# EAGLE board M1705X (EAGLE 6.6.0), part 1 of 2
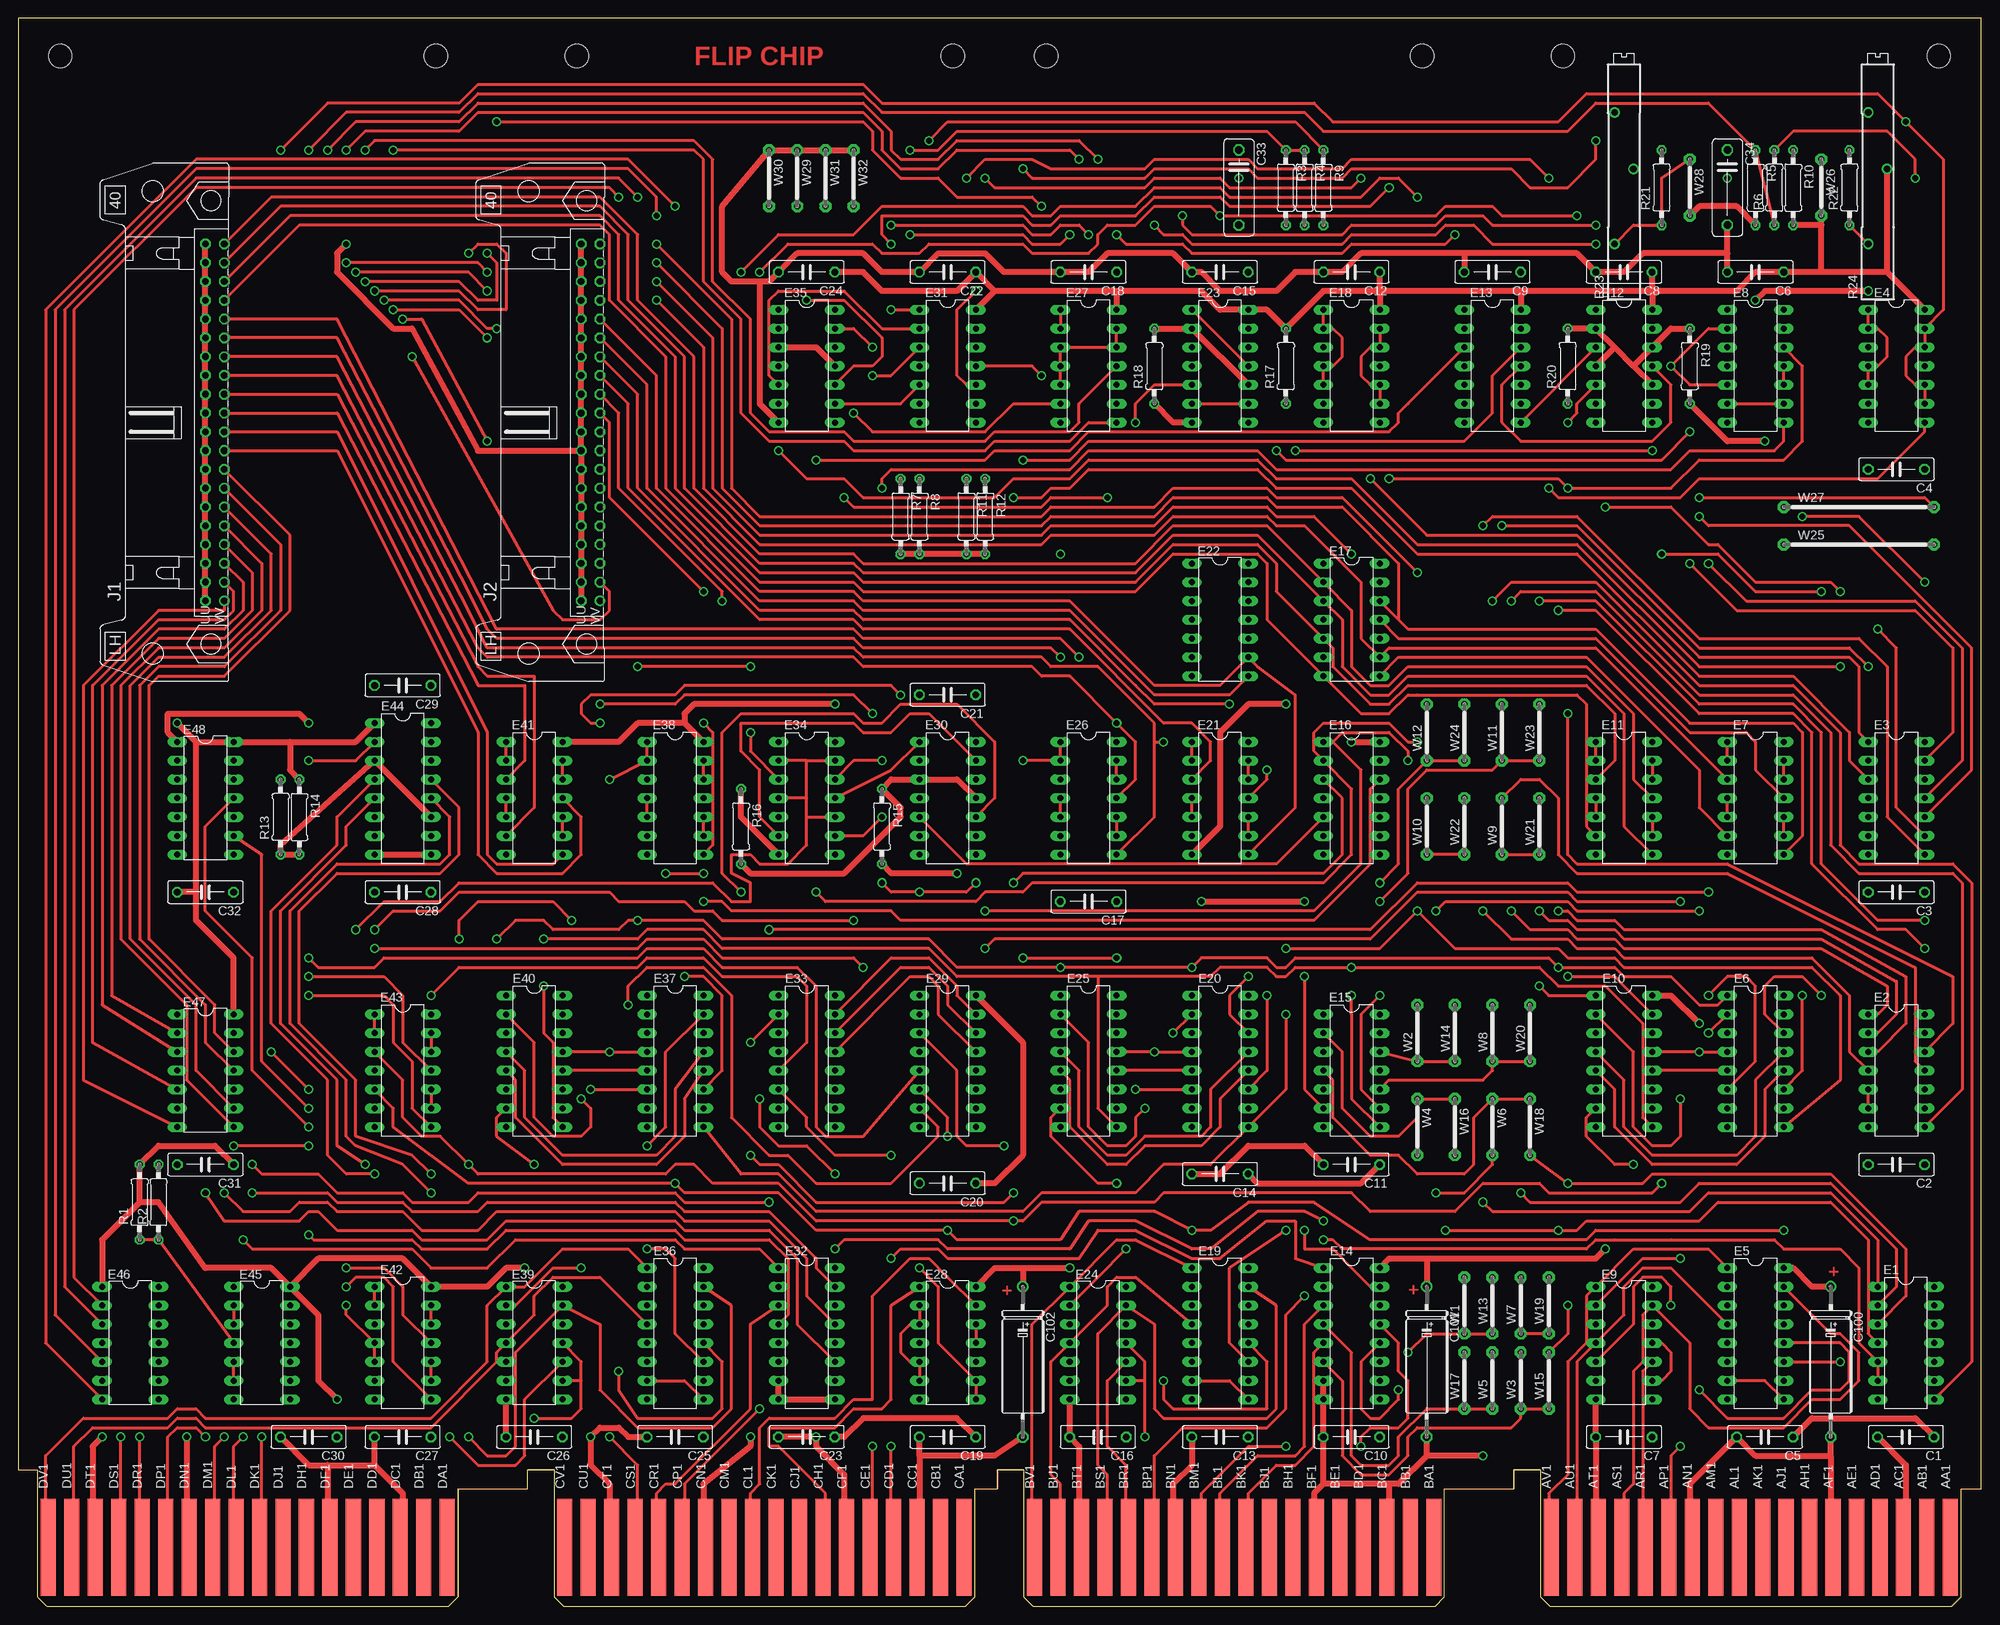
[diagram p3: board, top side]
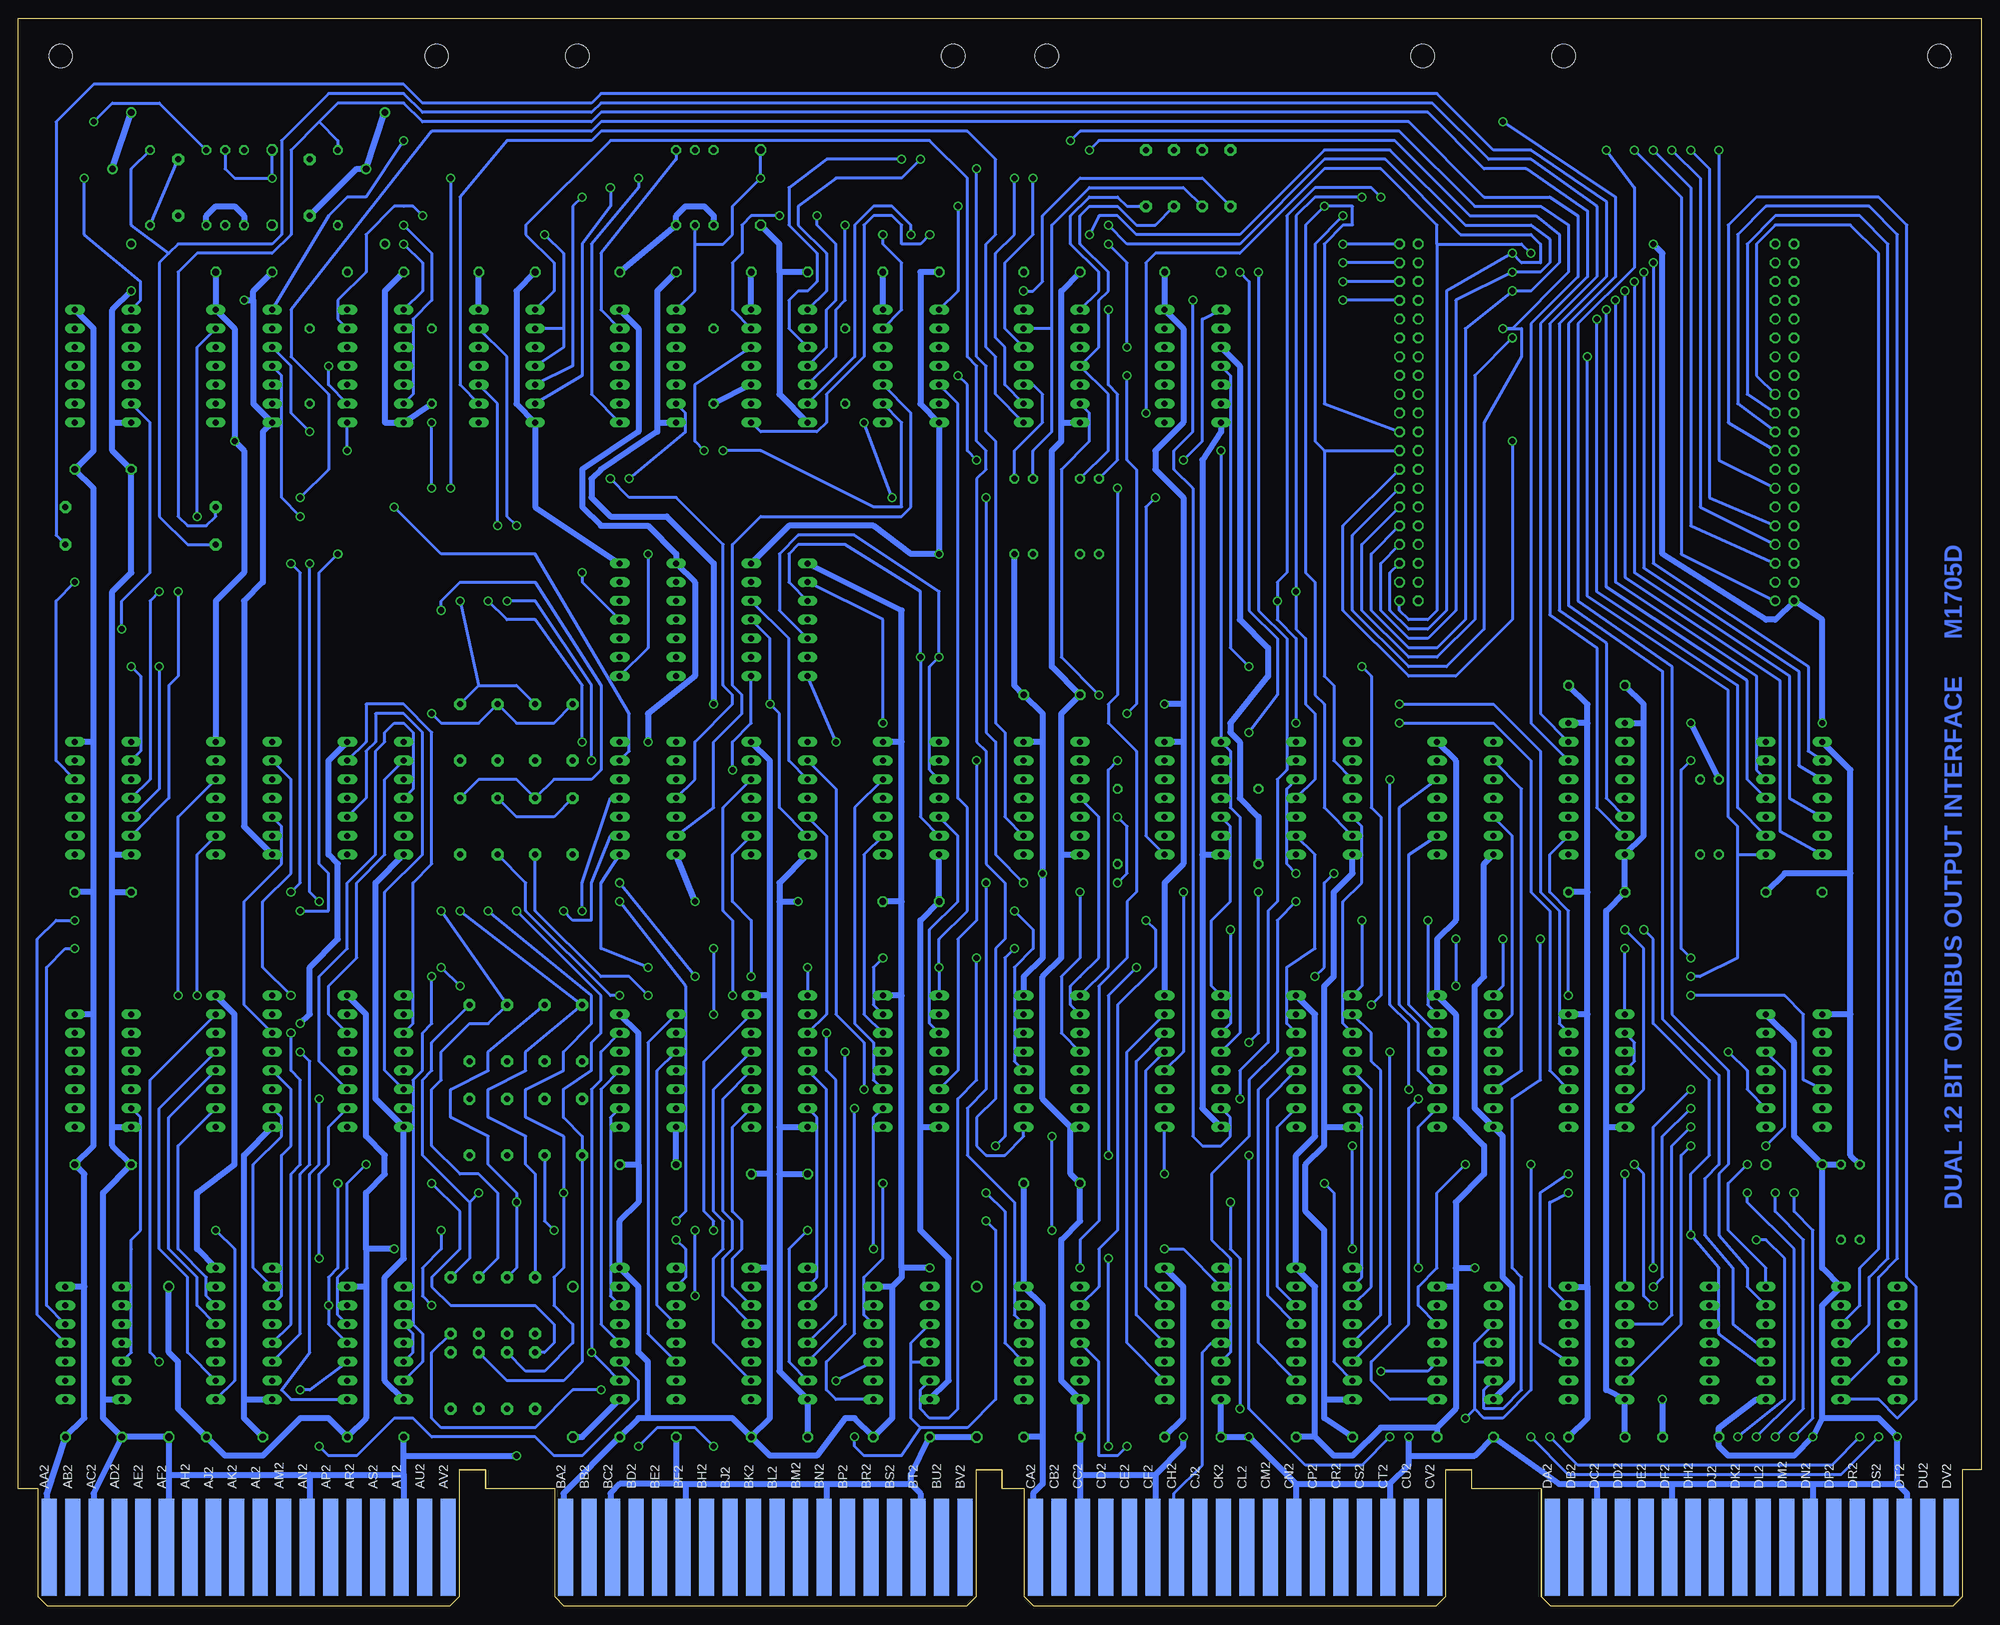
[diagram p4: board, bottom side, seen from below]

Size 265.3 x 214.63 mm. Coordinates in mm from the lower left corner, seen from the top.
Copper layers (1+16): Top 0.035mm / dielectric 1.5mm / Bottom 0.035mm
Design rules "16mils": minimum track width 16mil, minimum drill 32mil, track to track 15mil, track to pad 10mil, pad to pad 10mil, via to via 10mil, smd to smd 10mil, copper to edge 13mil, drill to drill 10mil, minimum pad ring 10mil, minimum via ring 8mil, stop-mask expansion 0mil, vias tented up to drill 0mil, thermal gap 10mil
Net classes: 1 Supply: width 0.813 mm

## Footprints (pad centres in the part's own frame; a part is rotated, then mirrored left to right if it is on the bottom)
C075-032X103 = drill 0.914 octagon: 1 -3.81,0; 2 3.81,0
C102-043X133 = drill 1.016 octagon: 1 -5.08,0; 2 5.08,0
E12-8 = drill 1.016: + -10.16,0 | drill 1.016 octagon: - 10.16,0
DIL14 = drill 0.813 long: 1 -7.62,-3.81; 2 -5.08,-3.81; 3 -2.54,-3.81; 4 0,-3.81; 5 2.54,-3.81; 6 5.08,-3.81; 7 7.62,-3.81; 8 7.62,3.81; 9 5.08,3.81; 10 2.54,3.81; 11 0,3.81; 12 -2.54,3.81; 13 -5.08,3.81; 14 -7.62,3.81
DIL16 = drill 0.813 long: 1 -8.89,-3.81; 2 -6.35,-3.81; 3 -3.81,-3.81; 4 -1.27,-3.81; 5 1.27,-3.81; 6 3.81,-3.81; 7 6.35,-3.81; 8 8.89,-3.81; 9 8.89,3.81; 10 6.35,3.81; 11 3.81,3.81; 12 1.27,3.81; 13 -1.27,3.81; 14 -3.81,3.81; 15 -6.35,3.81; 16 -8.89,3.81
DEC40PINH = drill 0.914 octagon: A 24.13,1.27; AA -3.81,1.27; B 24.13,-1.27; BB -3.81,-1.27; C 21.59,1.27; CC -6.35,1.27; D 21.59,-1.27; DD -6.35,-1.27; E 19.05,1.27; EE -8.89,1.27; F 19.05,-1.27; FF -8.89,-1.27; H 16.51,1.27; HH -11.43,1.27; J 16.51,-1.27; JJ -11.43,-1.27; K 13.97,1.27; KK -13.97,1.27; L 13.97,-1.27; LL -13.97,-1.27; M 11.43,1.27; MM -16.51,1.27; N 11.43,-1.27; NN -16.51,-1.27; P 8.89,1.27; PP -19.05,1.27; R 8.89,-1.27; RR -19.05,-1.27; S 6.35,1.27; SS -21.59,1.27; T 6.35,-1.27; TT -21.59,-1.27; U 3.81,1.27; UU -24.13,1.27; V 3.81,-1.27; W 1.27,1.27; X 1.27,-1.27; Y -1.27,1.27; Z -1.27,-1.27 | drill 0.914: VV -24.13,-1.27
0207/10 = drill 0.813 octagon: 1 -5.08,0; 2 5.08,0
3006Y = drill 0.9: 1 -8.89,1.27; 2 1.27,-1.27; 3 8.89,1.27
EDGE-CON8 = smd 2.032 x 13.106: AA1 261.303,7.938; AB1 258.127,7.938; AC1 254.952,7.938; AD1 251.778,7.938; AE1 248.602,7.938; AF1 245.428,7.938; AH1 242.252,7.938; AJ1 239.077,7.938; AK1 235.903,7.938; AL1 232.727,7.938; AM1 229.553,7.938; AN1 226.377,7.938; AP1 223.202,7.938; AR1 220.028,7.938; AS1 216.852,7.938; AT1 213.678,7.938; AU1 210.502,7.938; AV1 207.327,7.938; BA1 191.452,7.938; BB1 188.278,7.938; BC1 185.102,7.938; BD1 181.928,7.938; BE1 178.752,7.938; BF1 175.577,7.938; BH1 172.403,7.938; BJ1 169.227,7.938; BK1 166.053,7.938; BL1 162.877,7.938; BM1 159.702,7.938; BN1 156.528,7.938; BP1 153.352,7.938; BR1 150.178,7.938; BS1 147.002,7.938; BT1 143.827,7.938; BU1 140.653,7.938; BV1 137.477,7.938; CA1 127.953,7.938; CB1 124.778,7.938; CC1 121.603,7.938; CD1 118.427,7.938; CE1 115.252,7.938; CF1 112.078,7.938; CH1 108.903,7.938; CJ1 105.728,7.938; CK1 102.552,7.938; CL1 99.377,7.938; CM1 96.203,7.938; CN1 93.028,7.938; CP1 89.853,7.938; CR1 86.677,7.938; CS1 83.502,7.938; CT1 80.328,7.938; CU1 77.153,7.938; CV1 73.978,7.938; DA1 58.102,7.938; DB1 54.928,7.938; DC1 51.752,7.938; DD1 48.578,7.938; DE1 45.403,7.938; DF1 42.227,7.938; DH1 39.053,7.938; DJ1 35.877,7.938; DK1 32.703,7.938; DL1 29.527,7.938; DM1 26.352,7.938; DN1 23.177,7.938; DP1 20.003,7.938; DR1 16.828,7.938; DS1 13.652,7.938; DT1 10.477,7.938; DU1 7.303,7.938; DV1 4.128,7.938 | smd 2.032 x 13.106 bottom: AA2 261.303,7.938; AB2 258.127,7.938; AC2 254.952,7.938; AD2 251.778,7.938; AE2 248.602,7.938; AF2 245.428,7.938; AH2 242.252,7.938; AJ2 239.077,7.938; AK2 235.903,7.938; AL2 232.727,7.938; AM2 229.553,7.938; AN2 226.377,7.938; AP2 223.202,7.938; AR2 220.028,7.938; AS2 216.852,7.938; AT2 213.678,7.938; AU2 210.502,7.938; AV2 207.327,7.938; BA2 191.452,7.938; BB2 188.278,7.938; BC2 185.102,7.938; BD2 181.928,7.938; BE2 178.752,7.938; BF2 175.577,7.938; BH2 172.403,7.938; BJ2 169.227,7.938; BK2 166.053,7.938; BL2 162.877,7.938; BM2 159.702,7.938; BN2 156.528,7.938; BP2 153.352,7.938; BR2 150.178,7.938; BS2 147.002,7.938; BT2 143.827,7.938; BU2 140.653,7.938; BV2 137.477,7.938; CA2 127.953,7.938; CB2 124.778,7.938; CC2 121.603,7.938; CD2 118.427,7.938; CE2 115.252,7.938; CF2 112.078,7.938; CH2 108.903,7.938; CJ2 105.728,7.938; CK2 102.552,7.938; CL2 99.377,7.938; CM2 96.203,7.938; CN2 93.028,7.938; CP2 89.853,7.938; CR2 86.677,7.938; CS2 83.502,7.938; CT2 80.328,7.938; CU2 77.153,7.938; CV2 73.978,7.938; DA2 58.102,7.938; DB2 54.928,7.938; DC2 51.752,7.938; DD2 48.578,7.938; DE2 45.403,7.938; DF2 42.227,7.938; DH2 39.053,7.938; DJ2 35.877,7.938; DK2 32.703,7.938; DL2 29.527,7.938; DM2 26.352,7.938; DN2 23.177,7.938; DP2 20.003,7.938; DR2 16.828,7.938; DS2 13.652,7.938; DT2 10.477,7.938; DU2 7.303,7.938; DV2 4.128,7.938
OMNIBUS = hole 3.175: 208.915,209.55; 259.715,209.55; 189.865,209.55; 139.065,209.55; 75.616,209.55; 126.416,209.55; 56.566,209.55; 5.766,209.55
07 = drill 0.813 pad 1.6 octagon: 1 -3.81,0; 2 3.81,0
20 = drill 0.813 pad 1.6 octagon: 1 -10.16,0; 2 10.16,0

## Placement (x,y rotation side)
C1  .01uF  [C075-032X103]  255.14,22.86 180 top
C2  .01uF  [C075-032X103]  253.87,59.69 180 top
C3  .01uF  [C075-032X103]  253.87,96.52 180 top
C4  .01uF  [C075-032X103]  253.87,153.67 180 top
C5  .01uF  [C075-032X103]  236.09,22.86 180 top
C6  .01uF  [C075-032X103]  234.82,180.34 180 top
C7  .01uF  [C075-032X103]  217.04,22.86 180 top
C8  .01uF  [C075-032X103]  217.04,180.34 180 top
C9  .01uF  [C075-032X103]  199.26,180.34 180 top
C10  .01uF  [C075-032X103]  180.21,22.86 180 top
C11  .01uF  [C075-032X103]  180.21,59.69 180 top
C12  .01uF  [C075-032X103]  180.21,180.34 180 top
C13  .01uF  [C075-032X103]  162.43,22.86 180 top
C14  .01uF  [C075-032X103]  162.43,58.42 180 top
C15  .01uF  [C075-032X103]  162.43,180.34 180 top
C16  .01uF  [C075-032X103]  145.92,22.86 180 top
C17  .01uF  [C075-032X103]  144.65,95.25 180 top
C18  .01uF  [C075-032X103]  144.65,180.34 180 top
C19  .01uF  [C075-032X103]  125.6,22.86 180 top
C20  .01uF  [C075-032X103]  125.6,57.15 180 top
C21  .01uF  [C075-032X103]  125.6,123.19 180 top
C22  .01uF  [C075-032X103]  125.6,180.34 180 top
C23  .01uF  [C075-032X103]  106.55,22.86 180 top
C24  .01uF  [C075-032X103]  106.55,180.34 180 top
C25  .01uF  [C075-032X103]  88.77,22.86 180 top
C26  .01uF  [C075-032X103]  69.72,22.86 180 top
C27  .01uF  [C075-032X103]  51.94,22.86 180 top
C28  .01uF  [C075-032X103]  51.94,96.52 180 top
C29  .01uF  [C075-032X103]  51.94,124.46 180 top
C30  .01uF  [C075-032X103]  39.24,22.86 180 top
C31  .01uF  [C075-032X103]  25.27,59.69 180 top
C32  .01uF  [C075-032X103]  25.27,96.52 180 top
C33  68uF  [C102-043X133]  164.97,191.77 270 top
C34  68uF  [C102-043X133]  231.01,191.77 270 top
C100  6.8uF  [E12-8]  244.98,33.02 270 top
C101  6.8uF  [E12-8]  190.37,33.02 270 top
C102  6.8uF  [E12-8]  135.76,33.02 270 top
E1  7430N  [DIL14]  255.14,35.56 270 top
E2  7430N  [DIL14]  253.87,72.39 270 top
E3  7404N  [DIL14]  253.87,109.22 270 top
E4  7413N  [DIL14]  253.87,167.64 270 top
E5  8T38  [DIL16]  234.82,36.83 270 top
E6  74175N  [DIL16]  234.82,73.66 270 top
E7  7437N  [DIL14]  234.82,109.22 270 top
E8  7400N  [DIL14]  234.82,167.64 270 top
E9  N8881N  [DIL14]  217.04,35.56 270 top
E10  74175N  [DIL16]  217.04,73.66 270 top
E11  7437N  [DIL14]  217.04,109.22 270 top
E12  7474N  [DIL14]  217.04,167.64 270 top
E13  7408N  [DIL14]  199.26,167.64 270 top
E14  DS8837N  [DIL16]  180.21,36.83 270 top
E15  7404N  [DIL14]  180.21,72.39 270 top
E16  7400N  [DIL14]  180.21,109.22 270 top
E17  DEC2501  [DIL14]  180.21,133.35 270 top
E18  7413N  [DIL14]  180.21,167.64 270 top
E19  8T38  [DIL16]  162.43,36.83 270 top
E20  74175N  [DIL16]  162.43,73.66 270 top
E21  7437N  [DIL14]  162.43,109.22 270 top
E22  DEC2501  [DIL14]  162.43,133.35 270 top
E23  7437N  [DIL14]  162.43,167.64 270 top
E24  N8881N  [DIL14]  145.92,35.56 270 top
E25  74175N  [DIL16]  144.65,73.66 270 top
E26  7437N  [DIL14]  144.65,109.22 270 top
E27  7437N  [DIL14]  144.65,167.64 270 top
E28  N8881N  [DIL14]  125.6,35.56 270 top
E29  7442N  [DIL16]  125.6,73.66 270 top
E30  7474N  [DIL14]  125.6,109.22 270 top
E31  7486N  [DIL14]  125.6,167.64 270 top
E32  DS8837N  [DIL16]  106.55,36.83 270 top
E33  7442N  [DIL16]  106.55,73.66 270 top
E34  7408N  [DIL14]  106.55,109.22 270 top
E35  7474N  [DIL14]  106.55,167.64 270 top
E36  8T38  [DIL16]  88.77,36.83 270 top
E37  74175N  [DIL16]  88.77,73.66 270 top
E38  7437N  [DIL14]  88.77,109.22 270 top
E39  N8881N  [DIL14]  69.72,35.56 270 top
E40  74175N  [DIL16]  69.72,73.66 270 top
E41  7437N  [DIL14]  69.72,109.22 270 top
E42  7437N  [DIL14]  51.94,35.56 270 top
E43  7437N  [DIL14]  51.94,72.39 270 top
E44  74123N  [DIL16]  51.94,110.49 270 top
E45  N8881N  [DIL14]  32.89,35.56 270 top
E46  DEC2501  [DIL14]  15.11,35.56 270 top
E47  DEC2501  [DIL14]  25.27,72.39 270 top
E48  DEC2501  [DIL14]  25.27,109.22 270 top
J1  [DEC40PINH]  26.54,160.02 90 top
J2  [DEC40PINH]  77.34,160.02 90 top
R1  3.3K  [0207/10]  16.38,54.61 90 top
R2  10K  [0207/10]  18.92,54.61 90 top
R3  2.2K  [0207/10]  171.32,191.77 270 top
R4  2.2K  [0207/10]  173.86,191.77 270 top
R5  2.2K  [0207/10]  234.82,191.77 270 top
R6  2.2K  [0207/10]  237.36,191.77 90 top
R7  1K  [0207/10]  119.25,147.32 270 top
R8  1K  [0207/10]  121.79,147.32 270 top
R9  1.2K  [0207/10]  176.4,191.77 270 top
R10  1.2K  [0207/10]  239.9,191.77 270 top
R11  1K  [0207/10]  128.14,147.32 270 top
R12  1K  [0207/10]  130.68,147.32 270 top
R13  2.7K  [0207/10]  35.43,106.68 90 top
R14  7.5K  [0207/10]  37.97,106.68 270 top
R15  2.7K  [0207/10]  116.71,105.41 270 top
R16  7.5K  [0207/10]  97.66,105.41 270 top
R17  2.7K  [0207/10]  171.32,167.64 90 top
R18  7.5K  [0207/10]  153.54,167.64 90 top
R19  2.7K  [0207/10]  225.93,167.64 270 top
R20  7.5K  [0207/10]  209.42,167.64 90 top
R21  5.6K  [0207/10]  222.12,191.77 90 top
R22  5.6K  [0207/10]  247.52,191.77 90 top
R23  (option)  [3006Y]  217.04,193.04 90 top
R24  (option)  [3006Y]  251.33,193.04 90 top
U$2  [EDGE-CON8]  -0.13,0 0 top
U$3  [FLIPCHIP]  72.26,213.36 270 top
U$4  OUTLINE-OMNIBUS  [OMNIBUS]  -0.13,0 0 top
W1  J7MM  [07]  195.45,40.64 90 top
W2  J7MM  [07]  189.1,77.47 90 top
W3  J7MM  [07]  203.07,30.48 90 top
W4  J7MM  [07]  189.1,64.77 270 top
W5  J7MM  [07]  199.26,30.48 90 top
W6  J7MM  [07]  199.26,64.77 270 top
W7  J7MM  [07]  203.07,40.64 90 top
W8  J7MM  [07]  199.26,77.47 90 top
W9  J7MM  [07]  200.53,105.41 90 top
W10  J7MM  [07]  190.37,105.41 90 top
W11  J7MM  [07]  200.53,118.11 90 top
W12  J7MM  [07]  190.37,118.11 90 top
W13  J7MM  [07]  199.26,40.64 90 top
W14  J7MM  [07]  194.18,77.47 90 top
W15  J7MM  [07]  206.88,30.48 90 top
W16  J7MM  [07]  194.18,64.77 270 top
W17  J7MM  [07]  195.45,30.48 90 top
W18  J7MM  [07]  204.34,64.77 270 top
W19  J7MM  [07]  206.88,40.64 90 top
W20  J7MM  [07]  204.34,77.47 90 top
W21  J7MM  [07]  205.61,105.41 90 top
W22  J7MM  [07]  195.45,105.41 90 top
W23  J7MM  [07]  205.61,118.11 90 top
W24  J7MM  [07]  195.45,118.11 90 top
W25  J20MM  [20]  248.79,143.51 0 top
W26  J7MM  [07]  243.71,191.77 270 top
W27  J20MM  [20]  248.79,148.59 0 top
W28  J7MM  [07]  225.93,191.77 270 top
W29  J7MM  [07]  105.28,193.04 270 top
W30  J7MM  [07]  101.47,193.04 270 top
W31  J7MM  [07]  109.09,193.04 270 top
W32  J7MM  [07]  112.9,193.04 270 top

## Tracks (layer width: path | path; a pad name or v marks a point on that pad's centre or on a via)
3V1
  Top 0.813: R14.2 R13.1 35.43,102.87 E44.3 E44.11
3V2
  Top 0.813: R16.2 98.93,99.06 111.63,99.06 119.25,106.68 119.25,107.95 R15.1 117.98,111.76 E30.3 126.87,111.76 E30.11 | E35.3 107.82,170.18 E35.11
  Bottom 0.813: R16.2 97.66,106.68 100.2,109.22 100.2,116.84 101.47,118.11 101.47,119.38 96.39,125.73 96.39,129.54 100.2,133.35 100.2,167.64 E35.3
3V3
  Top 0.813: R18.2 E23.2 E23.10
  Bottom 0.813: E23.10 R17.1
3V4
  Top 0.813: R20.2 E12.2 215.77,170.18 | R19.1 223.39,172.72 E12.12 218.31,167.64 | 218.31,167.64 E12.10 | 215.77,170.18 218.31,167.64 | E12.4 215.77,170.18
!C0  (via drill 0.81)
  Top 0.406: U$2.CE1 115.44,8.26 v115.44,21.59
  Bottom 0.406: v115.44,21.59 116.71,20.32 119.25,20.32 119.25,33.02 E28.4
!C1
  Top 0.406: U$2.CH1 109.09,8.26 109.09,15.24 102.74,21.59 101.47,21.59 101.47,24.13 110.36,24.13 112.9,26.67 116.71,26.67 117.98,27.94 117.98,40.64 E28.1
!DATA0  (via drill 0.81)
  Top 0.406: U$2.AR1 219.58,8.26 219.58,31.75 E9.10 | v227.2,29.21 231.01,25.4 238.63,25.4 242.44,29.21 246.25,29.21 247.52,30.48 247.52,34.29 246.25,35.56 E5.12
  Bottom 0.406: E9.10 225.93,29.21 v227.2,29.21
!DATA1
  Top 0.406: U$2.AS1 217.04,8.26 217.04,15.24 218.31,16.51 218.31,31.75 219.58,33.02 219.58,39.37 E9.13 225.93,35.56 225.93,26.67 228.47,24.13 238.63,24.13 242.44,27.94 246.25,27.94 248.79,30.48 248.79,34.29 246.25,36.83 244.98,36.83 E5.15
!DATA2
  Top 0.406: U$2.AU1 210.69,8.26 210.69,33.02 E9.4 217.04,39.37 217.04,43.18 219.58,45.72 223.39,45.72 E5.4
!DATA3
  Top 0.406: U$2.AV1 206.88,8.26 206.88,15.24 209.42,17.78 209.42,33.02 211.96,35.56 211.96,41.91 E9.1 218.31,48.26 228.47,48.26 E5.1
!DATA4  (via drill 0.81)
  Top 0.406: U$2.BR1 149.73,8.26 149.73,19.05 147.19,21.59 147.19,30.48 E24.10 | E19.12 168.78,33.02 168.78,26.67 156.08,26.67 154.81,27.94 v154.81,30.48
  Bottom 0.406: E24.10 v154.81,30.48
!DATA5
  Top 0.406: U$2.BS1 147.19,8.26 147.19,17.78 145.92,19.05 145.92,36.83 E24.13 153.54,38.1 153.54,26.67 154.81,25.4 168.78,25.4 170.05,26.67 170.05,40.64 E19.15
!DATA6
  Top 0.406: U$2.BU1 140.84,8.26 140.84,16.51 139.57,17.78 139.57,33.02 E24.4 147.19,40.64 147.19,43.18 148.46,44.45 151,44.45 E19.4
!DATA7
  Top 0.406: U$2.BV1 137.03,8.26 137.03,38.1 E24.1 148.46,49.53 151,49.53 E19.1
!DATA8  (via drill 0.81)
  Top 0.406: U$2.DR1 16.38,8.26 v16.38,22.86 | v58.29,22.86 62.1,19.05 67.18,19.05 68.45,20.32 68.45,27.94 E39.10 | v81.15,31.75 81.15,29.21 83.69,25.4 93.85,25.4 95.12,26.67 95.12,33.02 E36.12
  Bottom 0.406: v16.38,22.86 20.19,19.05 54.48,19.05 v58.29,22.86 | E39.10 74.8,31.75 v81.15,31.75
!DATA9  (via drill 0.81)
  Top 0.406: U$2.DS1 13.84,8.26 v13.84,22.86 | v60.83,22.86 63.37,20.32 65.91,20.32 67.18,21.59 67.18,34.29 E39.13 78.61,38.1 78.61,29.21 83.69,24.13 93.85,24.13 96.39,26.67 96.39,40.64 E36.15
  Bottom 0.406: v13.84,22.86 18.92,17.78 55.75,17.78 v60.83,22.86
!DATA10
  Top 0.406: U$2.DU1 7.49,8.26 7.49,21.59 10.03,24.13 20.19,24.13 21.46,25.4 24,25.4 25.27,24.13 55.75,24.13 64.64,33.02 64.64,34.29 E39.4 69.72,39.37 69.72,41.91 72.26,44.45 78.61,44.45 E36.4
!DATA11
  Top 0.406: U$2.DV1 3.68,8.26 3.68,20.32 8.76,25.4 20.19,25.4 21.46,26.67 24,26.67 25.27,25.4 55.75,25.4 63.37,33.02 63.37,40.64 E39.1 68.45,43.18 73.53,48.26 82.42,48.26 E36.1
!INT_RQST  (via drill 0.81)
  Top 0.406: U$2.CP1 90.04,8.26 90.04,16.51 v100.2,26.67 | v31.62,59.69 32.89,58.42 40.51,58.42 43.05,55.88 51.94,55.88 53.21,54.61 60.83,54.61 62.1,55.88 88.77,55.88 90.04,54.61 v101.47,54.61
  Bottom 0.406: v101.47,54.61 101.47,48.26 100.2,46.99 v100.2,26.67 | E45.1 29.08,45.72 34.16,50.8 34.16,57.15 v31.62,59.69
!INTERNAL_IO
  Top 0.406: U$2.CL1 98.93,8.26 98.93,15.24 100.2,16.51 100.2,24.13 101.47,25.4 110.36,25.4 112.9,27.94 115.44,27.94 115.44,41.91 120.52,46.99 123.06,46.99 125.6,44.45 E28.13
!IO_PAUSE  (via drill 0.81)
  Top 0.406: U$2.CD1 117.98,8.26 v117.98,21.59 | v117.98,46.99 119.25,48.26 124.33,48.26 125.6,46.99 143.38,46.99 145.92,50.8 151,50.8 158.62,46.99 162.43,46.99 168.78,52.07 172.59,52.07 172.59,46.99 E14.1
  Bottom 0.406: v117.98,21.59 v117.98,46.99
!MD03  (via drill 0.81)
  Top 0.406: U$2.AP1 223.39,8.26 223.39,20.32 v224.66,21.59
  Bottom 0.406: v224.66,21.59 223.39,20.32 219.58,20.32 214.5,25.4 211.96,25.4 209.42,22.86 195.45,22.86 192.91,20.32 189.1,20.32 181.48,27.94 181.48,30.48 E14.11
!MD04
  Top 0.406: U$2.BK1 166.24,8.26 166.24,15.24 170.05,19.05 172.59,19.05 175.13,21.59 175.13,34.29 E14.5
!MD05
  Top 0.406: U$2.BL1 162.43,8.26 162.43,15.24 167.51,20.32 172.59,20.32 173.86,21.59 173.86,38.1 E14.3
!MD06  (via drill 0.81)
  Top 0.406: U$2.BM1 159.89,8.26 159.89,15.24 166.24,21.59 v171.32,21.59 | v181.48,21.59 181.48,22.86 182.75,24.13 186.56,24.13 187.83,25.4 187.83,30.48 186.56,31.75 186.56,35.56 E14.13
  Bottom 0.406: v171.32,21.59 173.86,24.13 178.94,24.13 v181.48,21.59
!MD07  (via drill 0.81)
  Top 0.406: U$2.BP1 153.54,8.26 153.54,20.32 157.35,24.13 168.78,24.13 171.32,26.67 171.32,39.37 v173.86,41.91 | v173.86,50.8 173.86,48.26 177.67,48.26 180.21,45.72 182.75,43.18 E14.15
  Bottom 0.406: v173.86,41.91 v173.86,50.8
!MD08  (via drill 0.81)
  Top 0.406: U$2.DK1 32.89,8.26 v32.89,22.86 | v30.35,49.53 31.62,48.26 53.21,48.26 55.75,45.72 63.37,45.72 67.18,49.53 88.77,49.53 90.04,48.26 100.2,48.26 E32.1
  Bottom 0.406: v32.89,22.86 26.54,27.94 26.54,46.99 29.08,49.53 v30.35,49.53
!MD09  (via drill 0.81)
  Top 0.406: U$2.DL1 29.08,8.26 29.08,21.59 v30.35,22.86 | v31.62,55.88 41.78,55.88 43.05,54.61 51.94,54.61 53.21,53.34 62.1,53.34 63.37,54.61 88.77,54.61 90.04,53.34 101.47,53.34 107.82,46.99 107.82,45.72 E32.15
  Bottom 0.406: v30.35,22.86 25.27,27.94 25.27,48.26 31.62,54.61 v31.62,55.88
!MD10  (via drill 0.81)
  Top 0.406: U$2.DM1 26.54,8.26 26.54,21.59 v27.81,22.86 | v27.81,55.88 30.35,53.34 36.7,53.34 37.97,54.61 41.78,54.61 43.05,53.34 51.94,53.34 54.48,50.8 62.1,50.8 64.64,53.34 88.77,53.34 90.04,52.07 101.47,52.07 106.55,46.99 106.55,41.91 E32.13
  Bottom 0.406: v27.81,22.86 24,26.67 24,49.53 27.81,53.34 v27.81,55.88
!MD11  (via drill 0.81)
  Top 0.406: U$2.DP1 20.19,8.26 20.19,22.86 21.46,24.13 24,24.13 v25.27,22.86 | v25.27,55.88 27.81,52.07 37.97,52.07 39.24,53.34 40.51,53.34 43.05,50.8 53.21,50.8 54.48,49.53 63.37,49.53 65.91,52.07 88.77,52.07 90.04,50.8 101.47,50.8 105.28,46.99 105.28,38.1 E32.11
  Bottom 0.406: v25.27,22.86 22.73,25.4 22.73,50.8 25.27,53.34 v25.27,55.88
!SKIP  (via drill 0.81)
  Top 0.406: U$2.CS1 83.69,8.26 83.69,19.05 v79.88,22.86 | v98.93,60.96 100.2,59.69 102.74,59.69 107.82,54.61 133.22,54.61 v134.49,55.88
  Bottom 0.406: v79.88,22.86 83.69,19.05 91.31,19.05 98.93,26.67 v98.93,60.96 | v134.49,55.88 131.95,53.34 131.95,35.56 E28.10
ACTLFLGH
  Top 0.406: E35.9 119.25,162.56 E31.5
AD00  (via drill 0.81)
  Top 0.406: v224.66,68.58 224.66,63.5 223.39,62.23 220.85,62.23 218.31,64.77 218.31,74.93 E10.2
  Bottom 0.406: E9.8 228.47,27.94 229.74,29.21 225.93,34.29 225.93,58.42 224.66,59.69 v224.66,68.58
AD00H
  Top 0.406: J1.B 34.16,190.5 78.61,190.5 83.69,185.42 83.69,176.53 91.31,168.91 91.31,151.13 100.2,142.24 112.9,142.24 114.17,140.97 151,140.97 156.08,146.05 168.78,146.05 E17.2 180.21,134.62 180.21,127 182.75,124.46 185.29,124.46 187.83,127 211.96,127 218.31,120.65 218.31,111.76 E11.11
AD00L
  Top 0.406: E11.13 E11.12
  Bottom 0.406: E10.3 211.96,78.74 211.96,97.79 209.42,100.33 209.42,118.11 213.23,121.92 218.31,121.92 218.31,116.84 E11.13
AD01  (via drill 0.81)
  Top 0.406: v218.31,59.69 215.77,59.69 211.96,63.5 211.96,66.04 E10.7
  Bottom 0.406: E9.12 222.12,39.37 222.12,44.45 220.85,45.72 220.85,57.15 v218.31,59.69
AD01H
  Top 0.406: J1.D 35.43,189.23 78.61,189.23 82.42,185.42 82.42,176.53 90.04,168.91 90.04,151.13 100.2,140.97 112.9,140.97 114.17,139.7 151,139.7 156.08,144.78 167.51,144.78 E17.3 178.94,133.35 178.94,127 182.75,123.19 185.29,123.19 187.83,125.73 211.96,125.73 217.04,120.65 217.04,105.41 E11.8
AD01L
  Top 0.406: E11.10 E11.9
  Bottom 0.406: E10.6 215.77,72.39 215.77,96.52 210.69,101.6 210.69,118.11 213.23,120.65 217.04,120.65 217.04,116.84 218.31,115.57 218.31,109.22 E11.10
AD02  (via drill 0.81)
  Top 0.406: v209.42,85.09 215.77,85.09 217.04,83.82 E10.15
  Bottom 0.406: E9.6 210.69,33.02 210.69,36.83 211.96,38.1 211.96,71.12 210.69,72.39 210.69,77.47 209.42,78.74 v209.42,85.09
AD02H
  Top 0.406: J1.F 36.7,187.96 78.61,187.96 81.15,185.42 81.15,176.53 88.77,168.91 88.77,151.13 100.2,139.7 112.9,139.7 114.17,138.43 151,138.43 156.08,143.51 167.51,143.51 170.05,140.97 170.05,137.16 E17.5 177.67,129.54 177.67,127 182.75,121.92 185.29,121.92 187.83,124.46 211.96,124.46 215.77,120.65 215.77,116.84 215.77,114.3 E11.3
AD02L
  Top 0.406: E11.2 E11.1
  Bottom 0.406: E10.14 223.39,80.01 223.39,83.82 219.58,87.63 219.58,97.79 215.77,101.6 215.77,111.76 E11.2
AD03  (via drill 0.81)
  Top 0.406: v224.66,46.99 219.58,46.99 E9.2
  Bottom 0.406: E10.10 223.39,64.77 223.39,59.69 224.66,58.42 v224.66,46.99
AD03H
  Top 0.406: J1.J 37.97,186.69 78.61,186.69 79.88,185.42 79.88,176.53 87.5,168.91 87.5,151.13 100.2,138.43 112.9,138.43 114.17,137.16 151,137.16 156.08,142.24 167.51,142.24 168.78,140.97 168.78,133.35 E17.7 181.48,120.65 185.29,120.65 187.83,123.19 189.1,123.19 210.69,123.19 211.96,121.92 211.96,105.41 E11.6
AD03L
  Top 0.406: E11.4 E11.5 E11.4
  Bottom 0.406: E10.11 224.66,73.66 224.66,85.09 220.85,88.9 220.85,97.79 217.04,101.6 217.04,115.57 215.77,116.84 215.77,118.11 214.5,119.38 213.23,119.38 211.96,118.11 211.96,110.49 E11.4
AD04  (via drill 0.81)
  Top 0.406: E25.2 144.65,76.2 144.65,64.77 147.19,62.23 149.73,62.23 151,63.5 151,66.04 v152.27,67.31
  Bottom 0.406: E24.8 154.81,27.94 156.08,29.21 156.08,33.02 152.27,36.83 v152.27,67.31
AD04H  (via drill 0.81)
  Top 0.406: J1.L 43.05,173.99 64.64,132.08 112.9,132.08 114.17,130.81 140.84,130.81 v143.38,128.27
  Bottom 0.406: E22.3 161.16,138.43 161.16,142.24 159.89,143.51 153.54,143.51 143.38,137.16 v143.38,128.27 143.38,106.68 E26.6
AD04L
  Top 0.406: E26.5 E26.4
  Bottom 0.406: E25.3 142.11,78.74 142.11,91.44 138.3,95.25 138.3,104.14 E26.5
AD05  (via drill 0.81)
  Top 0.406: v148.46,57.15 145.92,57.15 139.57,63.5 139.57,66.04 E25.7
  Bottom 0.406: E24.12 151,39.37 151,44.45 148.46,46.99 v148.46,57.15
AD05H  (via drill 0.81)
  Top 0.406: J1.N 43.05,171.45 60.83,137.16 63.37,132.08 64.64,130.81 112.9,130.81 114.17,129.54 139.57,129.54 v140.84,128.27
  Bottom 0.406: E26.3 142.11,113.03 142.11,127 v140.84,128.27 140.84,137.16 152.27,144.78 159.89,144.78 162.43,142.24 162.43,134.62 E22.5
AD05L  (via drill 0.81)
  Top 0.406: v135.76,114.3 E26.2 E26.1
  Bottom 0.406: E25.6 138.3,72.39 138.3,90.17 135.76,92.71 v135.76,114.3
AD06  (via drill 0.81)
  Top 0.406: v135.76,87.63 v148.46,87.63
  Bottom 0.406: E25.15 149.73,81.28 149.73,86.36 v148.46,87.63 | E24.6 143.38,29.21 143.38,26.67 142.11,25.4 139.57,25.4 138.3,26.67 138.3,68.58 135.76,71.12 v135.76,87.63
AD06H  (via drill 0.81)
  Top 0.406: J1.R 43.05,168.91 60.83,134.62 63.37,129.54 112.9,129.54 114.17,128.27 138.3,128.27 139.57,127 145.92,127 153.54,119.38 153.54,116.84 | 153.54,116.84 v154.81,116.84 | 153.54,116.84 153.54,106.68 E26.8
  Bottom 0.406: v154.81,116.84 E22.7
AD06L
  Top 0.406: E26.10 E26.9
  Bottom 0.406: E25.14 151,80.01 151,101.6 E26.9
AD07  (via drill 0.81)
  Top 0.406: v149.73,48.26 145.92,44.45 E24.2
  Bottom 0.406: E25.10 149.73,66.04 v149.73,48.26
AD07H  (via drill 0.81)
  Top 0.406: J1.T 43.05,166.37 62.1,129.54 63.37,128.27 112.9,128.27 114.17,127 137.03,127 138.3,125.73 142.11,125.73 v148.46,119.38 151,116.84 151,111.76 E26.11
  Bottom 0.406: E22.2 148.46,133.35 v148.46,119.38
AD07L
  Top 0.406: E26.12 E26.13
  Bottom 0.406: E25.11 149.73,71.12 149.73,76.2 152.27,78.74 152.27,107.95 E26.12
AD08  (via drill 0.81)
  Top 0.406: v76.07,68.58 77.34,67.31 77.34,64.77 76.07,63.5 72.26,63.5 69.72,66.04 69.72,76.2 E40.2
  Bottom 0.406: E39.8 79.88,27.94 82.42,30.48 82.42,33.02 77.34,38.1 77.34,67.31 v76.07,68.58
AD08H
  Top 0.406: J1.V 43.05,163.83 62.1,127 63.37,125.73 69.72,125.73 69.72,107.95 E41.6
  Bottom 0.406: J1.V 30.35,166.37 30.35,184.15 27.81,186.69 17.65,186.69 13.84,182.88 13.84,48.26 16.38,45.72 16.38,40.64 E46.12
AD08L
  Top 0.406: E41.5 E41.4
  Bottom 0.406: E40.3 63.37,80.01 63.37,104.14 E41.5
AD09  (via drill 0.81)
  Top 0.406: E40.7 64.64,66.04 64.64,63.5 v69.72,59.69
  Bottom 0.406: E39.12 76.07,40.64 76.07,43.18 73.53,45.72 73.53,55.88 v69.72,59.69
AD09H
  Top 0.406: J1.X 43.05,161.29 62.1,124.46 68.45,124.46 68.45,114.3 E41.3
  Bottom 0.406: J1.X 31.62,163.83 31.62,184.15 27.81,187.96 16.38,187.96 12.57,184.15 12.57,46.99 15.11,44.45 15.11,38.1 17.65,35.56 E46.11
AD09L
  Top 0.406: E41.2 E41.1
  Bottom 0.406: E40.6 62.1,72.39 62.1,110.49 E41.2
AD10  (via drill 0.81)
  Top 0.406: v74.8,92.71 72.26,95.25 62.1,95.25 59.56,92.71 v59.56,90.17
  Bottom 0.406: E39.6 67.18,29.21 67.18,26.67 64.64,26.67 62.1,29.21 62.1,44.45 63.37,45.72 63.37,68.58 59.56,71.12 v59.56,90.17 | E40.15 74.8,81.28 v74.8,92.71
AD10H
  Top 0.406: J1.Z 43.05,158.75 63.37,118.11 63.37,101.6 64.64,100.33 72.26,100.33 E41.8
  Bottom 0.406: J1.Z 32.89,162.56 32.89,185.42 29.08,189.23 15.11,189.23 11.3,185.42 11.3,46.99 13.84,44.45 13.84,34.29 17.65,30.48 E46.9
AD10L
  Top 0.406: E41.9 E41.10
  Bottom 0.406: E40.14 77.34,81.28 77.34,101.6 E41.9
AD11  (via drill 0.81)
  Top 0.406: v76.07,45.72 72.26,45.72 70.99,44.45 67.18,40.64 E39.2
  Bottom 0.406: E40.10 76.07,64.77 v76.07,45.72
AD11H
  Top 0.406: J1.BB 43.05,156.21 62.1,118.11 62.1,101.6 64.64,99.06 73.53,99.06 76.07,101.6 76.07,106.68 E41.11
  Bottom 0.406: J1.BB 34.16,160.02 34.16,186.69 30.35,190.5 13.84,190.5 10.03,186.69 10.03,44.45 8.76,43.18 8.76,27.94 11.3,25.4 13.84,27.94 E46.8
AD11L
  Top 0.406: E41.12 E41.13
  Bottom 0.406: E40.11 76.07,72.39 76.07,78.74 78.61,81.28 78.61,107.95 E41.12
ADFLAG  (via drill 0.81)
  Top 0.406: E8.2 228.47,172.72 v223.39,167.64 225.93,165.1 E8.5
  Bottom 0.406: E12.9 223.39,165.1 v223.39,167.64
ADONEH  (via drill 0.81)
  Top 0.406: J1.NN 31.62,139.7 31.62,134.62 27.81,130.81 18.92,130.81 12.57,124.46 12.57,82.55 E47.2 | v41.78,196.85 45.59,200.66 59.56,200.66 62.1,203.2 114.17,203.2 117.98,199.39 117.98,196.85 119.25,195.58 124.33,195.58 126.87,198.12 143.38,198.12 v145.92,195.58
  Bottom 0.406: J1.NN 37.97,148.59 37.97,193.04 v41.78,196.85 | E23.3 161.16,172.72 161.16,176.53 159.89,177.8 158.62,177.8 157.35,179.07 157.35,182.88 161.16,186.69 161.16,191.77 156.08,195.58 v145.92,195.58
ADONEL  (via drill 0.81)
  Top 0.406: J1.RR 30.35,138.43 30.35,134.62 27.81,132.08 18.92,132.08 11.3,124.46 11.3,81.28 E47.3 | v44.32,196.85 46.86,199.39 59.56,199.39 62.1,201.93 114.17,201.93 116.71,199.39 116.71,196.85 119.25,194.31 124.33,194.31 126.87,196.85 142.11,196.85 v143.38,195.58 | E23.1 E23.11
  Bottom 0.406: J1.RR 39.24,146.05 39.24,191.77 v44.32,196.85 | E23.1 156.08,177.8 156.08,182.88 159.89,186.69 159.89,189.23 154.81,193.04 145.92,193.04 v143.38,195.58
AFLAGH  (via drill 0.81)
  Top 0.406: J1.TT 29.08,137.16 29.08,134.62 27.81,133.35 18.92,133.35 10.03,124.46 10.03,76.2 E47.5 | v39.24,82.55 49.4,82.55 50.67,81.28 50.67,76.2 53.21,73.66 53.21,67.31 E43.8
  Bottom 0.406: E47.5 24,71.12 24,80.01 26.54,82.55 v39.24,82.55
AINITH  (via drill 0.81)
  Top 0.406: J1.VV 27.81,134.62 18.92,134.62 8.76,124.46 8.76,71.12 E47.7 | v46.86,196.85 48.13,198.12 91.31,198.12 93.85,195.58 93.85,179.07 98.93,173.99 98.93,161.29 101.47,158.75 111.63,158.75 112.9,157.48 130.68,157.48 131.95,158.75 142.11,158.75 143.38,160.02 143.38,162.56 E27.11
  Bottom 0.406: J1.VV 40.51,142.24 40.51,190.5 v46.86,196.85
AINTENH  (via drill 0.81)
  Top 0.406: v135.76,194.31 137.03,193.04 152.27,193.04 153.54,194.31 166.24,194.31 167.51,193.04 178.94,193.04 180.21,194.31 201.8,194.31 204.34,191.77 209.42,191.77 213.23,195.58 v213.23,198.12
  Bottom 0.406: E8.1 223.39,187.96 220.85,190.5 218.31,190.5 v213.23,198.12 | E30.9 131.95,106.68 131.95,118.11 133.22,119.38 133.22,157.48 134.49,158.75 134.49,167.64 135.76,168.91 v135.76,194.31
AIOT0L
  Bottom 0.406: E34.5 101.47,105.41 101.47,95.25 104.01,92.71 104.01,83.82 E33.1
AIOT1L  (via drill 0.81)
  Top 0.406: v98.93,76.2 E33.2 | v97.66,96.52 95.12,99.06 95.12,118.11 97.66,120.65 112.9,120.65 114.17,119.38 116.71,119.38 119.25,121.92 126.87,121.92 131.95,116.84 131.95,109.22 E30.10
  Bottom 0.406: v97.66,96.52 97.66,77.47 v98.93,76.2
AIOT2H  (via drill 0.81)
  Top 0.406: E3.10 264.03,113.03 264.03,129.54 247.52,146.05 228.47,146.05 v227.2,147.32
  Bottom 0.406: v227.2,147.32 229.74,149.86 229.74,166.37 E8.4
AIOT2L  (via drill 0.81)
  Top 0.406: v228.47,96.52 210.69,96.52 209.42,97.79 189.1,97.79 182.75,91.44 v101.47,91.44 | v228.47,140.97 233.55,135.89 256.41,135.89 262.76,129.54 262.76,114.3 E3.11
  Bottom 0.406: E33.3 101.47,78.74 v101.47,91.44 | v228.47,96.52 227.2,97.79 227.2,139.7 v228.47,140.97
AIOT3H  (via drill 0.81)
  Top 0.406: v191.64,93.98 192.91,95.25 209.42,95.25 210.69,93.98 v227.2,93.98 | v222.12,142.24 229.74,142.24 234.82,137.16 v243.71,137.16
  Bottom 0.406: v222.12,142.24 224.66,139.7 224.66,100.33 223.39,99.06 223.39,93.98 v227.2,93.98 | E16.9 185.29,104.14 187.83,97.79 187.83,92.71 190.37,92.71 v191.64,93.98 | E3.6 244.98,109.22 244.98,124.46 243.71,125.73 v243.71,137.16
AIOT3L  (via drill 0.81)
  Top 0.406: v102.74,156.21 106.55,152.4 111.63,152.4 114.17,149.86 131.95,149.86 134.49,152.4 142.11,152.4 144.65,154.94 167.51,154.94 170.05,152.4 180.21,152.4 189.1,143.51 210.69,143.51 227.2,127 v246.25,127
  Bottom 0.406: E3.5 246.25,110.49 v246.25,127 | v102.74,156.21 E34.1 101.47,115.57 101.47,107.95 100.2,106.68 100.2,77.47 E33.4
AIOT4L  (via drill 0.81)
  Top 0.406: E33.5 106.55,76.2 106.55,83.82 105.28,85.09 95.12,85.09 92.58,87.63 84.96,87.63 83.69,86.36 59.56,86.36 v55.75,82.55
  Bottom 0.406: E44.10 58.29,101.6 58.29,96.52 55.75,93.98 v55.75,82.55
AIOT5L  (via drill 0.81)
  Top 0.406: v117.98,60.96 110.36,60.96 106.55,64.77 106.55,66.04 E33.6 | v48.13,88.9 83.69,88.9 84.96,90.17 92.58,90.17 95.12,87.63 112.9,87.63 v114.17,86.36 | E43.2 E43.1
  Bottom 0.406: v114.17,86.36 117.98,82.55 v117.98,60.96 | E43.1 v48.13,88.9 | E43.4 46.86,73.66 46.86,76.2 E43.2
AIOT6L  (via drill 0.81)
  Top 0.406: E35.10 112.9,167.64 115.44,167.64 116.71,168.91 116.71,171.45 111.63,176.53 v106.55,176.53
  Bottom 0.406: E33.7 101.47,66.04 101.47,63.5 102.74,62.23 105.28,62.23 106.55,63.5 106.55,151.13 109.09,153.67 109.09,156.21 106.55,158.75 v106.55,176.53
AIOT7L  (via drill 0.81)
  Top 0.406: v100.2,68.58 100.2,64.77 102.74,62.23 106.55,62.23 v110.36,58.42 | v97.66,180.34 102.74,185.42 112.9,185.42 116.71,189.23 135.76,189.23 137.03,187.96 139.57,187.96 140.84,189.23 151,189.23 153.54,191.77 162.43,191.77 163.7,190.5 181.48,190.5 184.02,193.04 186.56,193.04 v189.1,190.5
  Bottom 0.406: v97.66,180.34 97.66,134.62 93.85,130.81 93.85,113.03 95.12,111.76 95.12,95.25 96.39,93.98 96.39,76.2 100.2,72.39 v100.2,68.58 | v110.36,58.42 E33.9 | v189.1,190.5 190.37,189.23 190.37,167.64 E13.5
AIOTL  (via drill 0.81)
  Top 0.406: E2.8 262.76,69.85 262.76,97.79 261.49,99.06 248.79,99.06 244.98,102.87 244.98,118.11 239.9,123.19 227.2,123.19 213.23,137.16 203.07,137.16 v201.8,135.89 | v189.1,116.84 187.83,116.84 185.29,119.38 176.4,119.38 175.13,118.11 175.13,115.57 E16.2 180.21,110.49 180.21,101.6 176.4,97.79 137.03,97.79 135.76,96.52 130.68,96.52 129.41,95.25 109.09,95.25 v107.82,96.52
  Bottom 0.406: v201.8,135.89 199.26,133.35 195.45,133.35 189.1,124.46 v189.1,116.84 | E33.12 107.82,74.93 v107.82,96.52
AREADY
  Top 0.406: E13.11 200.53,165.1 200.53,160.02 203.07,157.48 220.85,157.48 223.39,160.02 223.39,165.1 E12.11
AREADYH  (via drill 0.81)
  Top 0.406: J1.LL 32.89,140.97 32.89,134.62 27.81,129.54 18.92,129.54 13.84,124.46 13.84,90.17 22.73,81.28 22.73,71.12 E47.8 | v39.24,196.85 44.32,201.93 59.56,201.93 62.1,204.47 114.17,204.47 116.71,201.93 173.86,201.93 176.4,199.39 209.42,199.39 213.23,203.2 228.47,203.2 R5.1 R6.1
  Bottom 0.406: J1.LL 36.7,149.86 36.7,194.31 v39.24,196.85
AREADYL  (via drill 0.81)
  Top 0.406: v35.43,196.85 41.78,203.2 59.56,203.2 62.1,205.74 114.17,205.74 116.71,203.2 175.13,203.2 177.67,200.66 208.15,200.66 211.96,204.47 251.33,204.47 v255.14,200.66 260.22,195.58 260.22,175.26 E4.13 E4.12 256.41,170.18 255.14,168.91 255.14,166.37 256.41,165.1 E4.10 E4.9 | E47.11 25.27,76.2 25.27,81.28 16.38,90.17 16.38,124.46 18.92,127 27.81,127 35.43,134.62 35.43,143.51 J1.FF
  Bottom 0.406: v35.43,196.85 35.43,154.94 J1.FF | v255.14,200.66 252.6,203.2 246.25,203.2 R10.1
ASTROBEH  (via drill 0.81)
  Top 0.406: J1.JJ 34.16,142.24 34.16,134.62 27.81,128.27 18.92,128.27 15.11,124.46 15.11,90.17 24,81.28 24,72.39 E47.9 | v39.24,69.85 v34.16,74.93 | v44.32,45.72 49.4,45.72 51.94,43.18 51.94,40.64 51.94,39.37 E42.11
  Bottom 0.406: E47.9 31.62,69.85 31.62,72.39 v34.16,74.93 | v39.24,69.85 44.32,64.77 v44.32,45.72
ASTROBEL  (via drill 0.81)
  Top 0.406: J1.DD 36.7,144.78 36.7,134.62 27.81,125.73 18.92,125.73 17.65,124.46 17.65,90.17 26.54,81.28 26.54,77.47 E47.12 | v39.24,62.23 v29.08,62.23
  Bottom 0.406: E42.6 40.51,38.1 40.51,60.96 v39.24,62.23 | E47.12 26.54,72.39 26.54,64.77 v29.08,62.23
BCTLFLGH
  Top 0.406: E31.2 116.71,172.72 111.63,177.8 102.74,177.8 101.47,176.53 101.47,166.37 E35.5
BD00  (via drill 0.81)
  Top 0.406: E5.11 v246.25,33.02
  Bottom 0.406: E6.15 247.52,71.12 247.52,34.29 v246.25,33.02
BD00H  (via drill 0.81)
  Top 0.406: v86.23,184.15 96.39,173.99 96.39,151.13 100.2,147.32 138.3,147.32 139.57,148.59 153.54,148.59 156.08,151.13 168.78,151.13 170.05,149.86 178.94,149.86 v189.1,139.7 | E17.11 186.56,130.81 213.23,130.81 225.93,118.11 233.55,118.11 234.82,116.84 234.82,113.03 E7.11
  Bottom 0.406: J2.B v86.23,184.15 | E17.11 189.1,138.43 v189.1,139.7
BD00L  (via drill 0.81)
  Top 0.406: v243.71,82.55 241.17,85.09 237.36,85.09 236.09,83.82 236.09,80.01 E6.14 | E7.12 E7.13
  Bottom 0.406: E7.12 243.71,106.68 v243.71,82.55
BD01
  Bottom 0.406: E5.14 239.9,41.91 239.9,44.45 243.71,48.26 243.71,62.23 E6.10
BD01H  (via drill 0.81)
  Top 0.406: v86.23,181.61 95.12,172.72 95.12,151.13 100.2,146.05 138.3,146.05 139.57,147.32 153.54,147.32 156.08,149.86 168.78,149.86 170.05,148.59 178.94,148.59 186.56,140.97 186.56,133.35 | 186.56,133.35 187.83,132.08 213.23,132.08 225.93,119.38 239.9,119.38 241.17,118.11 241.17,104.14 E7.8 | 186.56,133.35 E17.12
  Bottom 0.406: J2.D v86.23,181.61
BD01L  (via drill 0.81)
  Top 0.406: E6.11 241.17,72.39 v241.17,82.55 | E7.9 E7.10
  Bottom 0.406: E7.9 241.17,101.6 v241.17,82.55
BD02  (via drill 0.81)
  Top 0.406: v228.47,77.47 E6.2
  Bottom 0.406: v228.47,77.47 228.47,72.39 227.2,71.12 227.2,59.69 228.47,58.42 228.47,38.1 E5.5
BD02H  (via drill 0.81)
  Top 0.406: v86.23,179.07 93.85,171.45 93.85,151.13 100.2,144.78 138.3,144.78 139.57,146.05 153.54,146.05 156.08,148.59 168.78,148.59 170.05,147.32 175.13,147.32 v180.21,142.24 | E17.8 186.56,128.27 211.96,128.27 227.2,113.03 227.2,107.95 E7.6
  Bottom 0.406: J2.F v86.23,179.07 | E17.8 180.21,129.54 v180.21,142.24
BD02L
  Top 0.406: E7.5 E7.4
  Bottom 0.406: E6.3 234.82,81.28 234.82,95.25 229.74,100.33 229.74,105.41 E7.5
BD03
  Bottom 0.406: E5.2 233.55,45.72 233.55,59.69 229.74,63.5 229.74,66.04 E6.7
BD03H  (via drill 0.81)
  Top 0.406: v86.23,176.53 92.58,170.18 92.58,151.13 100.2,143.51 138.3,143.51 139.57,144.78 153.54,144.78 156.08,147.32 168.78,147.32 170.05,146.05 173.86,146.05 181.48,138.43 181.48,130.81 E17.9 185.29,129.54 213.23,129.54 E7.3
  Bottom 0.406: J2.J v86.23,176.53
BD03L  (via drill 0.81)
  Top 0.406: v228.47,82.55 231.01,85.09 233.55,85.09 234.82,83.82 234.82,73.66 E6.6 | E7.2 E7.1
  Bottom 0.406: v228.47,82.55 232.28,86.36 232.28,95.25 228.47,99.06 228.47,111.76 E7.2
BD04  (via drill 0.81)
  Top 0.406: v171.32,50.8 163.7,45.72 163.7,35.56 E19.11
  Bottom 0.406: E20.15 172.59,73.66 172.59,53.34 171.32,52.07 v171.32,50.8
BD04H
  Top 0.406: J2.L 86.23,166.37 86.23,151.13 100.2,137.16 112.9,137.16 114.17,135.89 142.11,135.89 153.54,124.46 161.16,124.46 162.43,124.46 E22.9 167.51,127 172.59,123.19 172.59,107.95 E21.8
BD04L  (via drill 0.81)
  Top 0.406: E20.14 163.7,80.01 163.7,82.55 v166.24,85.09 | E21.9 E21.10
  Bottom 0.406: E21.9 168.78,101.6 168.78,95.25 166.24,92.71 v166.24,85.09
BD05
  Bottom 0.406: E20.10 168.78,64.77 168.78,53.34 167.51,52.07 167.51,48.26 168.78,46.99 168.78,43.18 E19.14
BD05H  (via drill 0.81)
  Top 0.406: E21.11 168.78,111.76 v168.78,113.03 | J2.N 84.96,165.1 84.96,151.13 100.2,135.89 112.9,135.89 114.17,134.62 142.11,134.62 153.54,123.19 163.7,123.19 E22.8
  Bottom 0.406: E22.8 166.24,119.38 168.78,116.84 v168.78,113.03
BD05L  (via drill 0.81)
  Top 0.406: E20.11 168.78,72.39 v168.78,82.55 | E21.12 E21.13
  Bottom 0.406: E21.12 170.05,107.95 170.05,93.98 168.78,92.71 v168.78,82.55
BD06  (via drill 0.81)
  Top 0.406: v156.08,77.47 E20.2
  Bottom 0.406: v156.08,77.47 156.08,72.39 154.81,71.12 154.81,39.37 E19.5
BD06H  (via drill 0.81)
  Top 0.406: J2.R 83.69,163.83 83.69,151.13 100.2,134.62 112.9,134.62 114.17,133.35 142.11,133.35 151,124.46 153.54,121.92 v163.7,121.92
  Bottom 0.406: E22.11 163.7,130.81 v163.7,121.92 162.43,120.65 162.43,107.95 E21.6
BD06L
  Top 0.406: E21.5 E21.4
  Bottom 0.406: E20.3 156.08,80.01 156.08,104.14 E21.5
BD07
  Bottom 0.406: E19.2 157.35,44.45 157.35,66.04 E20.7
BD07H
  Top 0.406: J2.T 82.42,162.56 82.42,151.13 100.2,133.35 112.9,133.35 114.17,132.08 142.11,132.08 154.81,119.38 158.62,119.38 161.16,116.84 161.16,114.3 E21.3
  Bottom 0.406: E22.12 161.16,130.81 161.16,114.3 E21.3
BD07L  (via drill 0.81)
  Top 0.406: v151,69.85 E20.6 | E21.2 E21.1
  Bottom 0.406: E21.2 154.81,110.49 154.81,80.01 151,76.2 v151,69.85
BD08  (via drill 0.81)
  Top 0.406: E36.11 88.77,36.83 88.77,46.99 87.5,48.26 v84.96,48.26 | v84.96,62.23 87.5,64.77 87.5,74.93 E37.15
  Bottom 0.406: v84.96,48.26 v84.96,62.23
BD08H  (via drill 0.81)
  Top 0.406: v92.58,119.38 93.85,118.11 93.85,102.87 E38.8 | v81.15,190.5 79.88,191.77 24,191.77 7.49,175.26 7.49,44.45 E46.2 | J2.V 81.15,161.29 81.15,151.13 95.12,137.16 v95.12,135.89
  Bottom 0.406: v81.15,190.5 82.42,191.77 90.04,191.77 93.85,187.96 93.85,139.7 95.12,138.43 v95.12,135.89 95.12,133.35 92.58,130.81 v92.58,119.38
BD08L
  Top 0.406: E38.9 E38.10
  Bottom 0.406: E38.9 90.04,101.6 90.04,88.9 93.85,86.36 93.85,78.74 E37.14
BD09
  Bottom 0.406: E36.14 95.12,43.18 95.12,64.77 E37.10
BD09H  (via drill 0.81)
  Top 0.406: E46.3 6.22,43.18 6.22,175.26 24,193.04 81.15,193.04 v83.69,190.5 | J2.X 79.88,160.02 79.88,149.86 v92.58,137.16
  Bottom 0.406: E38.11 90.04,111.76 90.04,120.65 91.31,121.92 91.31,130.81 92.58,132.08 v92.58,137.16 92.58,187.96 90.04,190.5 v83.69,190.5
BD09L  (via drill 0.81)
  Top 0.406: v90.04,85.09 92.58,85.09 95.12,82.55 95.12,72.39 E37.11 | v87.5,99.06 v92.58,99.06 | E38.12 E38.13
  Bottom 0.406: E38.12 93.85,110.49 93.85,100.33 v92.58,99.06 | v87.5,99.06 88.77,97.79 88.77,86.36 v90.04,85.09
BD10
  Bottom 0.406: E36.5 81.15,39.37 81.15,72.39 82.42,73.66 82.42,77.47 E37.2
BD10H  (via drill 0.81)
  Top 0.406: E46.7 3.68,35.56 3.68,175.26 24,195.58 82.42,195.58 v88.77,189.23
  Bottom 0.406: J2.Z 88.77,162.56 88.77,184.15 86.23,186.69 84.96,186.69 84.96,189.23 v88.77,189.23 91.31,186.69 91.31,139.7 90.04,138.43 90.04,123.19 88.77,121.92 88.77,107.95 E38.6
BD10L
  Top 0.406: E38.5 E38.4
  Bottom 0.406: E38.5 83.69,105.41 83.69,97.79 86.23,95.25 86.23,78.74 E37.3
BD11
  Bottom 0.406: E36.2 83.69,44.45 83.69,66.04 E37.7
BD11H  (via drill 0.81)
  Top 0.406: v86.23,187.96 86.23,190.5 82.42,194.31 24,194.31 4.95,175.26 4.95,39.37 E46.5
  Bottom 0.406: 88.77,156.21 J2.BB | 88.77,156.21 90.04,157.48 90.04,184.15 v86.23,187.96 | E38.3 87.5,114.3 87.5,124.46 88.77,125.73 88.77,156.21
BD11L  (via drill 0.81)
  Top 0.406: v77.34,69.85 E37.6 | v79.88,111.76 E38.2 E38.1
  Bottom 0.406: v77.34,69.85 77.34,78.74 79.88,81.28 v79.88,111.76
BDFLAG  (via drill 0.81)
  Top 0.406: E8.12 241.17,167.64 241.17,157.48 238.63,154.94 227.2,154.94 223.39,151.13 v209.42,151.13 208.15,152.4 v185.29,152.4 | v209.42,160.02 210.69,161.29 210.69,162.56 E12.5
  Bottom 0.406: E16.4 173.86,111.76 173.86,116.84 168.78,121.92 168.78,123.19 170.05,124.46 170.05,143.51 176.4,149.86 182.75,149.86 v185.29,152.4 | v209.42,151.13 v209.42,160.02
BDONEH  (via drill 0.81)
  Top 0.406: v44.32,181.61 62.1,181.61 v63.37,180.34 | v120.52,185.42 135.76,185.42 137.03,184.15 140.84,184.15 v142.11,185.42
  Bottom 0.406: J2.NN 81.15,140.97 81.15,134.62 77.34,130.81 74.8,130.81 70.99,134.62 70.99,176.53 v63.37,180.34 59.56,180.34 58.29,181.61 58.29,184.78 60.83,186.69 69.72,186.69 79.88,196.85 88.77,196.85 100.2,185.42 114.17,185.42 116.71,187.96 119.25,187.96 v120.52,185.42 | E48.2 23.37,115.57 23.37,127 44.32,140.97 v44.32,181.61 | v142.11,185.42 143.38,184.15 145.92,184.15 145.92,186.69 147.19,187.96 149.73,187.96 151,186.69 151,168.91 156.08,163.83 156.08,160.02 157.35,158.75 164.97,158.75 E23.8
BDONEL  (via drill 0.81)
  Top 0.406: v46.86,179.07 59.56,179.07 62.1,176.53 64.64,176.53 64.64,181.61 v63.37,182.88 | v117.98,186.69 135.76,186.69 137.03,185.42 139.57,185.42 140.84,186.69 143.38,186.69 v144.65,185.42 | E23.6 E23.9
  Bottom 0.406: J2.RR 79.88,139.7 79.88,134.62 77.34,132.08 74.8,132.08 72.26,134.62 72.26,177.8 v63.37,182.88 62.1,181.61 59.56,181.61 59.56,184.15 60.83,185.42 70.36,185.42 80.52,195.58 88.77,195.58 100.2,184.15 115.44,184.15 v117.98,186.69 | E48.5 25.91,109.22 25.91,125.73 46.86,139.7 v46.86,179.07 | v144.65,185.42 144.65,186.69 147.19,189.23 149.73,189.23 152.27,186.69 152.27,168.91 E23.6
BFLAGH  (via drill 0.81)
  Top 0.406: J2.TT 79.88,137.16 79.88,134.62 78.61,133.35 73.53,133.35 72.26,134.62 v53.21,168.91 | v39.24,85.09 49.4,85.09 51.94,82.55 | 51.94,82.55 51.94,80.01 | E43.11 51.94,76.2 51.94,82.55
  Bottom 0.406: 32.89,101.6 E48.8 | 32.89,101.6 32.89,105.41 34.16,106.68 34.16,123.83 53.21,136.53 v53.21,168.91 | 32.89,101.6 32.89,87.63 37.97,85.09 v39.24,85.09
BINITH  (via drill 0.81)
  Top 0.406: v48.13,177.8 59.56,177.8 62.1,175.26 65.91,175.26 65.91,182.88 64.64,184.15 62.1,184.15 v60.83,182.88 | v112.9,161.29 115.44,158.75 130.68,158.75 134.49,162.56 E27.6
  Bottom 0.406: J2.VV 78.61,134.62 77.34,133.35 74.8,133.35 73.53,134.62 73.53,184.15 | 73.53,184.15 62.1,184.15 v60.83,182.88 | 73.53,184.15 73.53,186.69 81.15,194.31 88.77,194.31 100.2,182.88 111.63,182.88 112.9,181.61 v112.9,161.29 | v48.13,177.8 48.13,139.06 27.18,125.09 27.18,104.78 E48.7
BINTENH
  Top 0.406: E16.5 170.05,100.33 128.14,100.33 E30.5
BIOT0L  (via drill 0.81)
  Top 0.406: E34.12 112.9,114.3 v116.71,114.3
  Bottom 0.406: E29.1 117.98,86.36 117.98,113.03 v116.71,114.3
BIOT1L
  Bottom 0.406: E29.2 123.06,81.28 123.06,83.82 121.79,85.09 119.25,87.63 119.25,106.68 E30.4
BIOT2H  (via drill 0.81)
  Top 0.406: v241.17,147.32 248.79,147.32 v257.68,138.43
  Bottom 0.406: E3.12 260.22,114.3 260.22,135.89 v257.68,138.43 | E8.13 241.17,170.18 v241.17,147.32
BIOT2L  (via drill 0.81)
  Top 0.406: E3.13 261.49,118.11 261.49,129.54 256.41,134.62 232.28,134.62 v225.93,140.97 | v133.22,62.23 128.14,62.23 126.87,63.5 126.87,72.39 E29.3 | v130.68,88.9 131.95,90.17 182.75,90.17 189.1,96.52 209.42,96.52 210.69,95.25 v224.66,95.25
  Bottom 0.406: v133.22,62.23 131.95,63.5 131.95,87.63 v130.68,88.9 | v224.66,95.25 225.93,96.52 v225.93,140.97
BIOT3H  (via drill 0.81)
  Top 0.406: v214.5,148.59 223.39,148.59 228.47,143.51 229.74,143.51 234.82,138.43 244.98,138.43 v246.25,137.16
  Bottom 0.406: E3.4 247.52,111.76 247.52,135.89 v246.25,137.16 | E16.13 182.75,115.57 182.75,120.65 195.45,142.24 208.15,142.24 v214.5,148.59
BIOT3L  (via drill 0.81)
  Top 0.406: E3.3 247.52,114.3 247.52,118.11 239.9,125.73 227.2,125.73 210.69,142.24 189.1,142.24 180.21,151.13 170.05,151.13 167.51,153.67 144.65,153.67 142.11,151.13 139.57,151.13 138.3,149.86 v134.49,149.86 | v116.71,97.79 117.98,96.52 v121.79,96.52 128.14,96.52 v129.41,97.79 | E34.9 114.17,104.14 v116.71,106.68
  Bottom 0.406: v129.41,97.79 133.22,101.6 133.22,116.84 134.49,118.11 v134.49,149.86 | E29.4 124.33,77.47 124.33,85.09 121.79,87.63 v121.79,96.52 | v116.71,97.79 115.44,99.06 115.44,105.41 v116.71,106.68
BIOT4L  (via drill 0.81)
  Top 0.406: E29.5 114.17,63.5 109.09,63.5 107.82,64.77 107.82,83.82 105.28,86.36 95.12,86.36 92.58,88.9 84.96,88.9 83.69,87.63 49.4,87.63 48.13,86.36 40.51,86.36 v39.24,87.63 | E44.2 45.59,114.3 v39.24,114.3
  Bottom 0.406: v39.24,87.63 40.51,88.9 40.51,113.03 v39.24,114.3
BIOT5L  (via drill 0.81)
  Top 0.406: v238.63,50.8 213.23,50.8 211.96,49.53 182.75,49.53 175.13,54.61 166.24,54.61 161.16,50.8 v158.62,50.8 153.54,53.34 143.38,53.34 140.84,49.53 126.87,49.53 v125.6,50.8 107.82,50.8 102.74,55.88 90.04,55.88 v88.77,57.15 60.83,57.15 50.67,64.77 50.67,67.31 E43.5 | E29.6 125.6,66.04 v125.6,63.5 | E36.7 90.04,30.48 E36.9 | E5.7 236.09,30.48 E5.9 | E19.7 163.7,30.48 E19.9
  Bottom 0.406: E5.9 236.09,30.48 236.09,48.26 v238.63,50.8 | E19.7 161.16,33.02 161.16,48.26 v158.62,50.8 | v125.6,50.8 v125.6,63.5 | E36.7 87.5,33.02 87.5,55.88 v88.77,57.15
BIOT6L  (via drill 0.81)
  Top 0.406: v82.42,81.28 82.42,83.82 84.96,86.36 92.58,86.36 96.39,82.55 96.39,66.04 101.47,60.96 104.01,60.96 107.82,57.15 117.98,57.15 124.33,63.5 124.33,64.77 E29.7 | v98.93,127 v83.69,127
  Bottom 0.406: E35.4 101.47,166.37 101.47,129.54 v98.93,127 | v83.69,127 82.42,125.73 82.42,107.95 81.15,106.68 81.15,82.55 v82.42,81.28
BIOT7L
  Bottom 0.406: E13.1 192.91,177.8 192.91,181.61 196.72,185.42 196.72,186.69 185.29,198.12 142.11,198.12 137.03,193.04 137.03,168.91 135.76,167.64 135.76,157.48 134.49,156.21 134.49,153.67 135.76,152.4 135.76,116.84 134.49,115.57 134.49,100.33 131.95,97.79 131.95,90.17 133.22,88.9 133.22,68.58 135.76,66.04 135.76,62.23 134.49,60.96 131.95,60.96 129.41,63.5 E29.9
BIOTL  (via drill 0.81)
  Top 0.406: E1.8 264.03,33.02 264.03,97.79 261.49,100.33 248.79,100.33 246.25,102.87 246.25,118.11 239.9,124.46 227.2,124.46 213.23,138.43 201.8,138.43 v199.26,135.89 | 177.67,116.84 178.94,118.11 185.29,118.11 187.83,115.57 v187.83,114.3 | 177.67,116.84 E16.1 | 177.67,116.84 181.48,113.03 181.48,100.33 175.13,93.98 v130.68,93.98
  Bottom 0.406: v199.26,135.89 195.45,135.89 187.83,124.46 v187.83,114.3 | E29.12 130.68,73.66 130.68,86.36 128.14,88.9 128.14,91.44 v130.68,93.98
BREADY
  Top 0.406: E13.8 E12.3
BREADYH  (via drill 0.81)
  Top 0.406: v45.59,180.34 60.83,180.34 v63.37,177.8 | v120.52,196.85 124.33,196.85 126.87,199.39 168.78,199.39 R3.1 R4.1
  Bottom 0.406: J2.LL 82.42,142.24 82.42,134.62 77.34,129.54 73.53,129.54 69.72,133.35 69.72,172.72 v63.37,177.8 60.83,177.8 57.02,181.61 57.02,185.42 60.2,187.96 69.09,187.96 79.25,198.12 119.25,198.12 v120.52,196.85 | E48.3 24.64,113.67 24.64,126.36 45.59,140.34 v45.59,180.34
BREADYL  (via drill 0.81)
  Top 0.406: v49.4,176.53 59.56,176.53 63.37,172.72 v64.64,172.72 | v123.06,198.12 125.6,200.66 172.59,200.66 R9.1 | E18.13 E18.12 182.75,170.18 181.48,168.91 181.48,166.37 182.75,165.1 E18.10 E18.9
  Bottom 0.406: J2.FF 84.96,144.78 84.96,134.62 77.34,127 72.26,127 67.18,132.08 67.18,160.02 62.1,168.91 62.1,172.72 v64.64,172.72 63.37,172.72 55.75,180.34 55.75,186.69 59.56,189.23 68.45,189.23 78.61,199.39 121.79,199.39 v123.06,198.12 | E48.12 30.35,113.03 30.35,125.73 49.4,138.43 v49.4,176.53 | R9.1 176.4,195.58 186.56,182.88 186.56,175.26 E18.13
BSTROBEH  (via drill 0.81)
  Top 0.406: v50.67,175.26 59.56,175.26 v63.37,171.45 | E48.11 25.27,105.41 25.27,93.98 31.62,87.63 31.62,72.39 v39.24,64.77
  Bottom 0.406: J2.JJ 83.69,143.51 83.69,134.62 77.34,128.27 73.53,128.27 68.45,133.35 68.45,166.37 v63.37,171.45 | E48.11 31.62,111.76 31.62,125.09 50.67,137.79 v50.67,175.26 | E42.3 43.05,38.1 41.78,39.37 41.78,62.23 v39.24,64.77
BSTROBEL  (via drill 0.81)
  Top 0.406: v63.37,157.48 54.48,173.99 v51.94,173.99 | E48.9 32.89,101.6 32.89,73.66 v39.24,67.31 | v44.32,43.18 45.59,44.45 49.4,44.45 50.67,43.18 50.67,33.02 E42.8
  Bottom 0.406: J2.DD 86.23,146.05 86.23,134.62 77.34,125.73 70.99,125.73 63.37,133.35 v63.37,157.48 | E48.9 32.89,107.95 32.89,124.46 51.94,137.16 v51.94,173.99 | v39.24,67.31 43.05,63.5 43.05,44.45 v44.32,43.18
DATA0
  Top 0.406: E10.4 217.04,71.12 217.04,64.77 220.85,60.96 232.28,60.96 234.82,63.5 234.82,71.12 E6.13
  Bottom 0.406: E5.10 242.44,34.29 242.44,44.45 246.25,48.26 246.25,67.31 E6.13
DATA1
  Top 0.406: E10.5 215.77,69.85 215.77,64.77 220.85,59.69 232.28,59.69 236.09,63.5 236.09,69.85 E6.12
  Bottom 0.406: E5.13 241.17,40.64 241.17,44.45 244.98,48.26 244.98,66.04 E6.12
DATA2  (via drill 0.81)
  Top 0.406: E6.4 v227.2,74.93 E10.13
  Bottom 0.406: E5.6 227.2,36.83 227.2,58.42 225.93,59.69 225.93,73.66 v227.2,74.93
DATA3
  Top 0.406: E6.5 222.12,72.39 E10.12
  Bottom 0.406: E5.3 229.74,41.91 229.74,60.96 228.47,62.23 228.47,69.85 E6.5
DATA4
  Top 0.406: E25.4 143.38,72.39 143.38,64.77 147.19,60.96 149.73,60.96 152.27,63.5 159.89,63.5 161.16,64.77 161.16,69.85 E20.13
  Bottom 0.406: E19.10 171.32,35.56 171.32,46.99 170.05,48.26 170.05,52.07 171.32,53.34 171.32,69.85 E20.13
DATA5
  Top 0.406: E25.5 142.11,71.12 142.11,64.77 147.19,59.69 149.73,59.69 152.27,62.23 159.89,62.23 162.43,64.77 162.43,68.58 E20.12
  Bottom 0.406: E19.13 170.05,41.91 170.05,46.99 168.78,48.26 168.78,52.07 170.05,53.34 170.05,68.58 E20.12
DATA6  (via drill 0.81)
  Top 0.406: E25.13 v153.54,74.93 E20.4
  Bottom 0.406: v153.54,74.93 153.54,38.1 E19.6
DATA7
  Top 0.406: E20.5 E25.12
  Bottom 0.406: E19.3 156.08,43.18 156.08,69.85 E20.5
DATA8
  Top 0.406: E40.4 68.45,72.39 68.45,66.04 73.53,60.96 86.23,60.96 88.77,63.5 88.77,69.85 E37.13
  Bottom 0.406: E36.10 97.66,35.56 97.66,69.85 E37.13
DATA9
  Top 0.406: E40.5 67.18,71.12 67.18,66.04 73.53,59.69 86.23,59.69 90.04,63.5 90.04,68.58 E37.12
  Bottom 0.406: E36.13 96.39,41.91 96.39,68.58 E37.12
DATA10  (via drill 0.81)
  Top 0.406: E40.13 v79.88,74.93 E37.4
  Bottom 0.406: E36.6 79.88,38.1 v79.88,74.93
DATA11
  Top 0.406: E37.5 E40.12
  Bottom 0.406: E36.3 82.42,43.18 82.42,69.85 E37.5
GND  (via drill 0.81)